# EasyEDA Pro project ProPrj_FlightComputerV1_2026-02-14.epro

# Schematic Schematic1
Board Name: Board1; Create Date: 2026-01-06; Page Name: P1; Project Name: FlightComputerV1; Schematic Name: Schematic1; Update Date: 2026-02-13; Company: EasyEDA.com; Page Size: A4; Version: V1.0
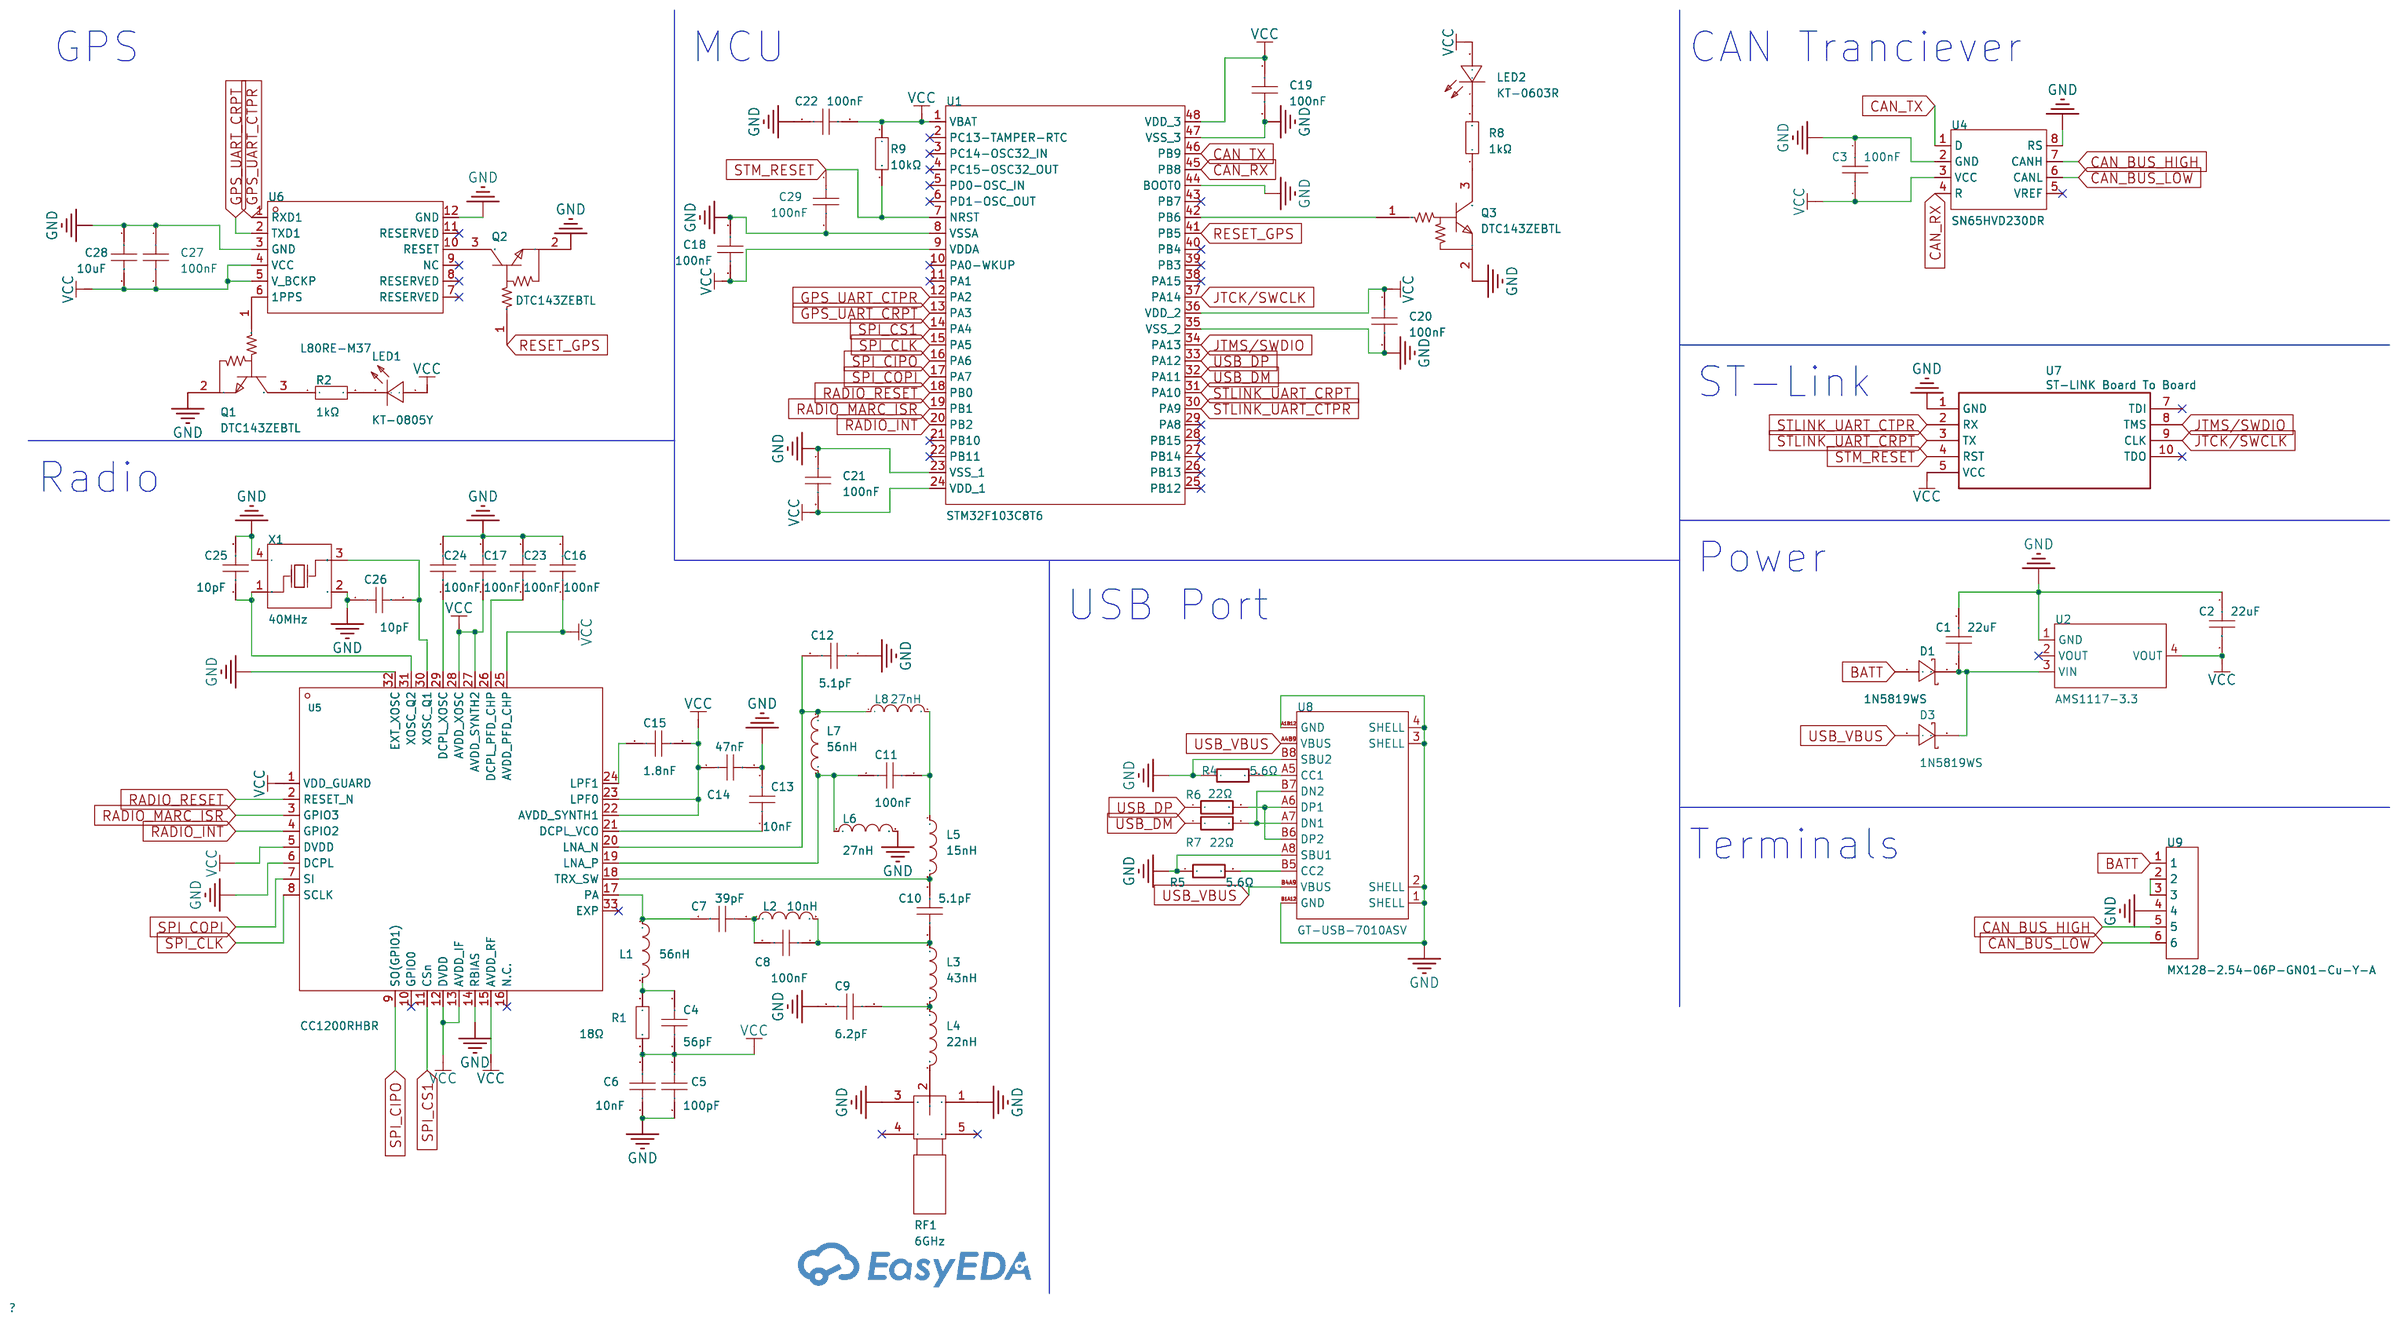
[diagram p0: schematic sheet]

## Parts
C1  22uF  [C0805]
C2  22uF  [C0805]
C3  100nF  [C0402]
C4  56pF  [C0402]
C5  100pF  [C0402]
C6  10nF  [C0402]
C7  39pF  [C0402]
C8  100nF  [C0402]
C9  6.2pF  [C0402]
C10  5.1pF  [C0402]
C11  100nF  [C0402]
C12  5.1pF  [C0402]
C13  10nF  [C0402]
C14  47nF  [C0402]
C15  1.8nF  [C0402]
C16  100nF  [C0402]
C17  100nF  [C0402]
C18  100nF  [C0402]
C19  100nF  [C0402]
C20  100nF  [C0402]
C21  100nF  [C0402]
C22  100nF  [C0402]
C23  100nF  [C0402]
C24  100nF  [C0402]
C25  10pF  [C0402]
C26  10pF  [C0402]
C27  100nF  [C0402]
C28  10uF  [C0603]
C29  100nF  [C0402]
D1  1N5819WS  [SOD-323_L1.8-W1.3-LS2.5-RD]
D3  1N5819WS  [SOD-323_L1.8-W1.3-LS2.5-RD]
L1  56nH  [L0402-R-RD]
L2  10nH  [L0402]
L3  43nH  [L0402]
L4  22nH  [L0402]
L5  15nH  [L0402-RD]
L6  27nH  [L0402-RD]
L7  56nH  [L0402-R-RD]
L8  27nH  [L0402-RD]
LED1  KT-0805Y  [LED0805-R-RD]
LED2  KT-0603R  [LED0603-RD]
Q1  DTC143ZEBTL  [SC-89-3_L1.6-W0.9-P1.00-LS1.6-BR]
Q2  DTC143ZEBTL  [SC-89-3_L1.6-W0.9-P1.00-LS1.6-BR]
Q3  DTC143ZEBTL  [SC-89-3_L1.6-W0.9-P1.00-LS1.6-BR]
R1  18Ω  [R0805]
R2  1kΩ  [R1206]
R4  5.6Ω  [R1206]
R5  5.6Ω  [R1206]
R6  22Ω  [R0603]
R7  22Ω  [R0603]
R8  1kΩ  [R1206]
R9  10kΩ  [R0402]
RF1  6GHz  [SMA-SMD_HYCW12-SMAW0863-1365B]
U1  STM32F103C8T6  [LQFP-48_L7.0-W7.0-P0.50-LS9.0-BL]
U2  AMS1117-3.3  [SOT-223-3_L6.5-W3.4-P2.30-LS7.0-BR]
U4  SN65HVD230DR  [SOIC-8_L4.9-W3.9-P1.27-LS6.0-BL]
U5  CC1200RHBR  [VQFN-32_L5.0-W5.0-P0.50-TL-EP]
U6  L80RE-M37  [GPSM-SMD_12P-L16.0-W16.0-P2.54-BL]
U7  ST-LINK Board To Board  [ST-LINK BOARD TO BOARD]
U8  GT-USB-7010ASV  [USB-C-SMD_G-SWITCH_GT-USB-7010ASV]
U9  MX128-2.54-06P-GN01-Cu-Y-A  [CONN-TH_6P-P2.54_MX128-2.54-6P]
X1  40MHz  [CRYSTAL-SMD_4P-L2.0-W1.6-BL]

## Library data of the parts
C1 C2 = CL21A226MAQNNNE: Capacitance:22uF Tolerance:±20% Tolerance:±20% Voltage Rating:25V Temperature Coefficient:X5R; LCSC Part Name: 22uF ±20% 25V; Supplier Part: C45783; Manufacturer: SAMSUNG(三星); Supplier Footprint: 0805; JLCPCB Part Class: Basic Part; Datasheet: https://item.szlcsc.com/datasheet/CL21A226MAQNNNE/46786.html; Supplier: LCSC; Tolerance: ±20%; Voltage Rating: 25V; Temperature Coefficient: X5R; Check: true
C3 C8 C11 C16-C24 C27 C29 = TCC0402X5R104M250AT: Capacitance:100nF Tolerance:±20% Tolerance:±20% Voltage Rating:25V Temperature Coefficient:X5R; LCSC Part Name: 100nF ±20% 25V; Supplier Part: C359190; Manufacturer: CCTC(三环); Supplier Footprint: 0402; JLCPCB Part Class: Extended Part; Datasheet: https://item.szlcsc.com/datasheet/TCC0402X5R104M250AT/333878.html; Supplier: LCSC; Tolerance: ±20%; Voltage Rating: 25V; Temperature Coefficient: X5R; Check: true
C4 = TCC0402COG560J500AT: Capacitance:56pF Tolerance:±5% Tolerance:±5% Voltage Rating:50V Temperature Coefficient:C0G; LCSC Part Name: 56pF ±5% 50V; Supplier Part: C696894; Manufacturer: CCTC(三环); Supplier Footprint: 0402; JLCPCB Part Class: Extended Part; Datasheet: https://item.szlcsc.com/datasheet/TCC0402COG560J500AT/730978.html; Supplier: LCSC; Tolerance: ±5%; Voltage Rating: 50V; Temperature Coefficient: C0G; Check: true
C5 = TCC0402COG101K500AT: Capacitance:100pF Tolerance:±10% Tolerance:±10% Voltage Rating:50V Temperature Coefficient:C0G; LCSC Part Name: 100pF ±10% 50V; Supplier Part: C696853; Manufacturer: CCTC(三环); Supplier Footprint: 0402; JLCPCB Part Class: Extended Part; Datasheet: https://item.szlcsc.com/datasheet/TCC0402COG101K500AT/730937.html; Supplier: LCSC; Tolerance: ±10%; Voltage Rating: 50V; Temperature Coefficient: C0G; Check: true
C6 C13 = TCC0402X7R103M500AT: Capacitance:10nF Tolerance:±20% Tolerance:±20% Voltage Rating:50V Temperature Coefficient:X7R; LCSC Part Name: 10nF ±20% 50V; Supplier Part: C696856; Manufacturer: CCTC(三环); Supplier Footprint: 0402; JLCPCB Part Class: Extended Part; Datasheet: https://item.szlcsc.com/datasheet/TCC0402X7R103M500AT/730940.html; Supplier: LCSC; Tolerance: ±20%; Voltage Rating: 50V; Temperature Coefficient: X7R; Check: true
C7 = TCC0402COG390J500AT: Capacitance:39pF Tolerance:±5% Tolerance:±5% Voltage Rating:50V Temperature Coefficient:C0G; LCSC Part Name: 39pF ±5% 50V; Supplier Part: C696912; Manufacturer: CCTC(三环); Supplier Footprint: 0402; JLCPCB Part Class: Extended Part; Datasheet: https://item.szlcsc.com/datasheet/TCC0402COG390J500AT/730996.html; Supplier: LCSC; Tolerance: ±5%; Voltage Rating: 50V; Temperature Coefficient: C0G; Check: true
C9 = 0402CG6R2C500NT: Capacitance:6.2pF Voltage Rating:50V Temperature Coefficient:C0G; LCSC Part Name: ±0.25pF 6.2pF 50V; Supplier Part: C41744; Manufacturer: FH(风华); Supplier Footprint: 0402; JLCPCB Part Class: Extended Part; Datasheet: https://item.szlcsc.com/datasheet/0402CG6R2C500NT/42730.html; Supplier: LCSC; Voltage Rating: 50V; Temperature Coefficient: C0G; Check: true
C10 C12 = 0402CG5R1C500NT: Capacitance:5.1pF Voltage Rating:50V Temperature Coefficient:C0G; LCSC Part Name: ±0.25pF 5.1pF 50V; Supplier Part: C60220; Manufacturer: FH(风华); Supplier Footprint: 0402; JLCPCB Part Class: Extended Part; Datasheet: https://item.szlcsc.com/datasheet/0402CG5R1C500NT/61272.html; Supplier: LCSC; Voltage Rating: 50V; Temperature Coefficient: C0G; Check: true
C14 = TCC0402X5R473M250AT: Capacitance:47nF Tolerance:±20% Tolerance:±20% Voltage Rating:25V Temperature Coefficient:X5R; LCSC Part Name: 47nF ±20% 25V; Supplier Part: C696864; Manufacturer: CCTC(三环); Supplier Footprint: 0402; JLCPCB Part Class: Extended Part; Datasheet: https://item.szlcsc.com/datasheet/TCC0402X5R473M250AT/730948.html; Supplier: LCSC; Tolerance: ±20%; Voltage Rating: 25V; Temperature Coefficient: X5R; Check: true
C15 = TCC0402X7R182K500AT: Capacitance:1.8nF Tolerance:±10% Tolerance:±10% Voltage Rating:50V Temperature Coefficient:X7R; LCSC Part Name: 1.8nF ±10% 50V; Supplier Part: C696873; Manufacturer: CCTC(三环); Supplier Footprint: 0402; JLCPCB Part Class: Extended Part; Datasheet: https://item.szlcsc.com/datasheet/TCC0402X7R182K500AT/730957.html; Supplier: LCSC; Tolerance: ±10%; Voltage Rating: 50V; Temperature Coefficient: X7R; Check: true
C25 C26 = TCC0402COG100K500AT: Capacitance:10pF Tolerance:±10% Tolerance:±10% Voltage Rating:50V Temperature Coefficient:C0G; LCSC Part Name: 10pF ±10% 50V; Supplier Part: C713505; Manufacturer: CCTC(三环); Supplier Footprint: 0402; JLCPCB Part Class: Extended Part; Datasheet: https://item.szlcsc.com/datasheet/TCC0402COG100K500AT/753905.html; Supplier: LCSC; Tolerance: ±10%; Voltage Rating: 50V; Temperature Coefficient: C0G; Check: true
C28 = CL10A106MQ8NNNC: Capacitance:10uF Tolerance:±20% Tolerance:±20% Voltage Rating:6.3V Temperature Coefficient:X5R; LCSC Part Name: 10uF ±20% 6.3V; Supplier Part: C1691; Manufacturer: SAMSUNG(三星); Supplier Footprint: 0603; JLCPCB Part Class: Extended Part; Datasheet: https://item.szlcsc.com/datasheet/CL10A106MQ8NNNC/2043.html; Supplier: LCSC; Tolerance: ±20%; Voltage Rating: 6.3V; Temperature Coefficient: X5R; Check: true
D1 D3 = 1N5819WS_C191023: Voltage - Forward(Vf@If):600mV@1A Voltage - DC Reverse(Vr):40V Current - Rectified:1A Non-Repetitive Peak Forward Surge Current:25A; LCSC Part Name: 电压:40V 电流:1A; Supplier Part: C191023; Manufacturer: Hottech(合科泰); Supplier Footprint: SOD-323; JLCPCB Part Class: Basic Part; Datasheet: https://item.szlcsc.com/datasheet/1N5819WS/213850.html; Supplier: LCSC; Voltage - Forward(Vf@If): 600mV@1A; Voltage - DC Reverse(Vr): 40V; Current - Rectified: 1A; Non-Repetitive Peak Forward Surge Current: 25A; Check: true
L1 L7 = MLG1005S56NJT000: Inductance:56nH Tolerance:±5% Tolerance:±5% Current Rating:200mA Current - Saturation (Isat):- DC Resistance(DCR):830mΩ Q @ Frequency:8@100MHz Frequency - Self Resonant:1GHz Ratings:-; LCSC Part Name: 56nH ±5%; Supplier Part: C76777; Manufacturer: TDK; Supplier Footprint: 0402; JLCPCB Part Class: Extended Part; Datasheet: https://item.szlcsc.com/datasheet/MLG1005S56NJT000/77904.html; Supplier: LCSC; Tolerance: ±5%; Current Rating: 200mA; DC Resistance(DCR): 830mΩ; Q @ Frequency: 8@100MHz; Frequency - Self Resonant: 1GHz; Check: true
L2 = VHF100505H10NJT: Inductance:10nH Tolerance:±5% Tolerance:±5% Current Rating:250mA Current - Saturation (Isat):- DC Resistance(DCR):470mΩ Q @ Frequency:7@100MHz Frequency - Self Resonant:3.2GHz Ratings:- Type:High-Frequency Inductor；Multilayer Inductor; LCSC Part Name: 10nH ±5%; Supplier Part: C90140; Manufacturer: FH(风华); Supplier Footprint: 0402; JLCPCB Part Class: Extended Part; Datasheet: https://item.szlcsc.com/datasheet/VHF100505H10NJT/91325.html; Supplier: LCSC; Tolerance: ±5%; Current Rating: 250mA; DC Resistance(DCR): 470mΩ; Q @ Frequency: 7@100MHz; Frequency - Self Resonant: 3.2GHz; Type: High-Frequency Inductor；Multilayer Inductor; Check: true
L3 = VHF100505HQ43NJT: Inductance: Tolerance:±5% Tolerance:±5% Rated Current: Saturation Current (Isat):- DC Resistance (DCR): Q @ Freq:- Frequency - Self Resonant:- Ratings:; LCSC Part Name: 43nH ±5%; Supplier Part: C395067; Manufacturer: FH(风华); Supplier Footprint: 0402; JLCPCB Part Class: Extended Part; Datasheet: https://atta.szlcsc.com/upload/public/pdf/source/20230208/097A5FD33363C9318A1C8B9447979AC6.pdf; Supplier: LCSC; Tolerance: ±5%; Check: true
L4 = VHF100505HQ22NJT: Inductance: Tolerance:±5% Tolerance:±5% Rated Current: Saturation Current (Isat):- DC Resistance (DCR): Q @ Freq:- Frequency - Self Resonant:- Ratings:; LCSC Part Name: 22nH ±5%; Supplier Part: C395059; Manufacturer: FH(风华); Supplier Footprint: 0402; JLCPCB Part Class: Extended Part; Datasheet: https://atta.szlcsc.com/upload/public/pdf/source/20230208/097A5FD33363C9318A1C8B9447979AC6.pdf; Supplier: LCSC; Tolerance: ±5%; Check: true
L5 = VHF100505H15NKT: Inductance: Tolerance:±10% Tolerance:±10% Rated Current: Saturation Current (Isat):- DC Resistance (DCR): Q @ Freq:- Frequency - Self Resonant:- Ratings:; LCSC Part Name: 15nH ±10%; Supplier Part: C381880; Manufacturer: FH(风华); Supplier Footprint: 0402; JLCPCB Part Class: Extended Part; Datasheet: https://atta.szlcsc.com/upload/public/pdf/source/20190415/C381906_6569A9E315E68CF95F175A191F7B4691.pdf; Supplier: LCSC; Tolerance: ±10%; Check: true
L6 L8 = LQG15HS27NJ02D: Inductance:27nH Tolerance:±5% Tolerance:±5% Current Rating:350mA Current - Saturation (Isat):- DC Resistance(DCR):460mΩ Q @ Frequency:8@100MHz Frequency - Self Resonant:1.7GHz Ratings:-; LCSC Part Name: 27nH ±5%; Supplier Part: C12669; Manufacturer: muRata(村田); Supplier Footprint: 0402; JLCPCB Part Class: Extended Part; Datasheet: https://item.szlcsc.com/datasheet/LQG15HS27NJ02D/13305.html; Supplier: LCSC; Tolerance: ±5%; Current Rating: 350mA; DC Resistance(DCR): 460mΩ; Q @ Frequency: 8@100MHz; Frequency - Self Resonant: 1.7GHz; Check: true
LED1 = KT-0805Y: Illumination Color:Yellow Voltage - Forward(Vf):1.8V~2.4V Voltage - Forward(Vf):1.8V~2.4V Power(Watts):40mW Forward Current:- Wavelength - Dominant:584nm~594nm Wavelength - Dominant:584nm~594nm Peak Wavelength:596nm Diode Configuration:- Lens Color:Water; LCSC Part Name: 0805 黄灯 高亮; Supplier Part: C2296; Manufacturer: KENTO; Supplier Footprint: 0805; Datasheet: https://item.szlcsc.com/datasheet/KT-0805Y/2669.html; Supplier: LCSC; Illumination Color: Yellow; Voltage - Forward(Vf): 1.8V~2.4V; Power(Watts): 40mW; Wavelength - Dominant: 584nm~594nm; Peak Wavelength: 596nm; Lens Color: Water Clear; Luminous Intensity: 175mcd; Viewing Angle: 120°; Operating Temperature: -40℃~+85℃
LED2 = KT-0603R: Emitted Color:Red Power Dissipation:- Forward Current:- Dominant Wavelength:- Dominant Wavelength:- Peak Wavelength:- Diode Configuration:- Lens Color:- Color Temperature:- Color Temperature:- Viewing Angle:- Mounting Sytle:- Operating Temperature:-40℃~+8; LCSC Part Name: 0603 红灯 高亮; Supplier Part: C2286; Manufacturer: KENTO; Supplier Footprint: 0603; Datasheet: https://atta.szlcsc.com/upload/public/pdf/source/20160616/1466072038404.pdf; Supplier: LCSC; Emitted Color: Red; Operating Temperature: -40℃~+85℃
Q1-Q3 = DTC143ZEBTL: Number:- Collector - Emitter Voltage VCEO:50V Current - Collector(Ic):100mA Pd - Power Dissipation:150mW DC Current Gain:80@10mA,5V Input Voltage (VI(on)@Ic,Vce):1.3V@5mA,0.3V Voltage - Input(Max)(VI(off)):500mV@100uA,5V Output Voltage(VO(on)):300mV@5mA,0; LCSC Part Name: NPN 100mA 50V 数字晶体管（内置偏置电阻晶体管）; Supplier Part: C308696; Manufacturer: ROHM(罗姆); Supplier Footprint: SC-89; JLCPCB Part Class: Extended Part; Datasheet: https://item.szlcsc.com/datasheet/DTC143ZEBTL/292370.html; Supplier: LCSC; Collector - Emitter Voltage VCEO: 50V; Current - Collector(Ic): 100mA; Pd - Power Dissipation: 150mW; DC Current Gain: 80@10mA,5V; Input Voltage (VI(on)@Ic,Vce): 1.3V@5mA,0.3V; Voltage - Input(Max)(VI(off)): 500mV@100uA,5V; Output Voltage(VO(on)): 300mV@5mA,0.25mA; Input Resistor: 4.7kΩ; Resistor Ratio: 10; Operating Temperature: -40℃~+150℃; Check: true
R1 = 0805W8F180JT5E: Type:Thick Film Resistor Resistance:18Ω Tolerance:±1% Tolerance:±1% Power(Watts):125mW Voltage-Supply(Max):150V Temperature Coefficient:±200ppm/℃ Temperature Coefficient:±200ppm/℃ Operating Temperature:-55℃~+155℃ Operating Temperature:-55℃~+155℃; LCSC Part Name: 18Ω ±1% 125mW 厚膜电阻; Supplier Part: C17507; Manufacturer: UNI-ROYAL(厚声); Supplier Footprint: 0805; JLCPCB Part Class: Extended Part; Datasheet: https://item.szlcsc.com/datasheet/0805W8F180JT5E/18195.html; Supplier: LCSC; Type: Thick Film Resistor; Tolerance: ±1%; Power(Watts): 125mW; Voltage-Supply(Max): 150V; Temperature Coefficient: ±200ppm/℃; Operating Temperature: -55℃~+155℃; Check: true
R2 R8 = 1206W4J0102T5E_C1469: Type:Thick Film Resistor Resistance:1kΩ Tolerance:±5% Tolerance:±5% Power(Watts):250mW Voltage-Supply(Max):200V Temperature Coefficient:±100ppm/℃ Temperature Coefficient:±100ppm/℃ Operating Temperature:-55℃~+155℃ Operating Temperature:-55℃~+155℃; LCSC Part Name: 1kΩ ±5% 250mW 厚膜电阻; Supplier Part: C1469; Manufacturer: UNI-ROYAL(厚声); Manufacturer Part: 1206W4J0102T5E; Supplier Footprint: 1206; JLCPCB Part Class: Extended Part; Datasheet: https://item.szlcsc.com/datasheet/1206W4J0102T5E/1821.html; Supplier: LCSC; Type: Thick Film Resistor; Tolerance: ±5%; Power(Watts): 250mW; Voltage-Supply(Max): 200V; Temperature Coefficient: ±100ppm/℃; Operating Temperature: -55℃~+155℃; Check: true
R4 R5 = RTT065R60FTP: Type:Thick Film Resistor Resistance:5.6Ω Tolerance:±1% Tolerance:±1% Power(Watts):250mW Voltage-Supply(Max):150V Temperature Coefficient:±200ppm/℃ Temperature Coefficient:±200ppm/℃ Operating Temperature:-55℃~+155℃ Operating Temperature:-55℃~+155℃; LCSC Part Name: 厚膜电阻 5.6Ω ±1% 250mW; Supplier Part: C4516; Manufacturer: RALEC(旺诠); Supplier Footprint: 1206; JLCPCB Part Class: Extended Part; Datasheet: https://item.szlcsc.com/datasheet/RTT065R60FTP/4923.html; Supplier: LCSC; Type: Thick Film Resistor; Tolerance: ±1%; Power(Watts): 250mW; Voltage-Supply(Max): 150V; Temperature Coefficient: ±200ppm/℃; Operating Temperature: -55℃~+155℃; Check: true
R6 R7 = 0603WAJ0220T5E: Type:Thick Film Resistors Resistance: Tolerance:±5% Tolerance:±5% Power(Watts): Overload Voltage (Max): Temperature Coefficient:±200ppm/℃ Temperature Coefficient:±200ppm/℃ Operating Temperature Range:-55℃~+155℃ Operating Temperature Range:-55℃~+155℃; LCSC Part Name: 22Ω ±5% 100mW 厚膜电阻; Supplier Part: C1203; Manufacturer: UNI-ROYAL(厚声); Supplier Footprint: 0603; JLCPCB Part Class: Extended Part; Datasheet: https://atta.szlcsc.com/upload/public/pdf/source/20200306/C422600_1E6D84923E4A46A82E41ADD87F860B5C.pdf; Supplier: LCSC; Type: Thick Film Resistors; Tolerance: ±5%; Temperature Coefficient: ±200ppm/℃; Operating Temperature Range: -55℃~+155℃; Check: true
R9 = 0402WGF1002TCE: Type:Thick Film Resistor Resistance:10kΩ Tolerance:±1% Tolerance:±1% Power(Watts):62.5mW Voltage-Supply(Max):50V Temperature Coefficient:±100ppm/℃ Temperature Coefficient:±100ppm/℃ Operating Temperature:-55℃~+155℃ Operating Temperature:-55℃~+155℃; LCSC Part Name: 10kΩ ±1% 62.5mW 厚膜电阻; Supplier Part: C25744; Manufacturer: UNI-ROYAL(厚声); Supplier Footprint: 0402; JLCPCB Part Class: Basic Part; Datasheet: https://item.szlcsc.com/datasheet/0402WGF1002TCE/26487.html; Supplier: LCSC; Type: Thick Film Resistor; Tolerance: ±1%; Power(Watts): 62.5mW; Voltage-Supply(Max): 50V; Temperature Coefficient: ±100ppm/℃; Operating Temperature: -55℃~+155℃
RF1 = HYCW12-SMAW0863-1365B: Connector Type:Board Side Interface:Inner Bore Number of Ports:1 Interface Diameter:5.2mm Interface Length/Height:8mm Frequency:6GHz RF Series:SMA Impedance:50Ω Operating Temperature Range:-55℃~+155℃ Operating Temperature Range:-55℃~+155℃; LCSC Part Name: 内孔 SMA; Supplier Part: C5301850; Manufacturer: 华宇创; Supplier Footprint: SMD; Datasheet: https://item.szlcsc.com/datasheet/HYCW12-SMAW0863-1365B/6053469.html; Supplier: LCSC; Connector Type: Board Side; Interface: Inner Bore; Number of Ports: 1; Interface Diameter: 5.2mm; Interface Length/Height: 8mm; RF Series: SMA; Impedance: 50Ω; Operating Temperature Range: -55℃~+155℃
U1 = STM32F103C8T6: CPU Core:ARM-M3 CPU Maximum Speed:72MHz Program Storage Size:64KB Program Memory Type:FLASH Number of I/O:37 ADC (Bit):12bit Voltage - Supply:2V~3.6V Voltage - Supply:2V~3.6V Applications:-; LCSC Part Name: 主流增强型ARM Cortex-M3 MCU，具有64 KB Flash、72 MHz CPU、电机控制、USB和CAN; Supplier Part: C8734; Manufacturer: ST(意法半导体); Supplier Footprint: LQFP-48(7x7); JLCPCB Part Class: Extended Part; Datasheet: https://item.szlcsc.com/datasheet/STM32F103C8T6/9243.html; Supplier: LCSC; CPU Core: ARM-M3; CPU Maximum Speed: 72MHz; Program Storage Size: 64KB; Program Memory Type: FLASH; Number of I/O: 37; ADC (Bit): 12bit; Voltage - Supply: 2V~3.6V; Check: true
U2 = AMS1117-3.3_C6186: Output Type:Fixed Voltage - Supply:16V Output Voltage:3.3V Output Voltage:3.3V Output Current:1A Power Supply Rejection Ratio (PSRR):72dB@(120Hz) Voltage Dropout:1.1V@(800mA) standby current:5mA Noise:0.003%Vout Features:Over Current Protection；Over Tempe; LCSC Part Name: 输出3.3V 1A; Supplier Part: C6186; Manufacturer: AMS; Supplier Footprint: SOT-223; JLCPCB Part Class: Basic Part; Datasheet: https://item.szlcsc.com/datasheet/AMS1117-3.3/6652.html; Supplier: LCSC; Output Type: Fixed; Voltage - Supply: 16V; Output Voltage: 3.3V; Output Current: 1A; Power Supply Rejection Ratio (PSRR): 72dB@(120Hz); Voltage Dropout: 1.1V@(800mA); standby current: 5mA; Noise: 0.003%Vout; Features: Over Current Protection；Over Temperature Protection; Operating Temperature: -40℃~+125℃; Output Configuration: Positive; Number of Outputs: 1; Check: true
U4 = SN65HVD230DR: Type:CANtransceiver Data Rate:1Mbps Voltage - Supply:- Voltage - Supply:- Current - Supply:- Operating Temperature:-40℃~+85℃ Operating Temperature:-40℃~+85℃; LCSC Part Name: 3.3-V CAN 收发器; Supplier Part: C12084; Manufacturer: TI(德州仪器); Supplier Footprint: SOIC-8; JLCPCB Part Class: Extended Part; Datasheet: https://www.ti.com/cn/lit/gpn/sn65hvd230; Supplier: LCSC; Type: CANtransceiver; Data Rate: 1Mbps; Operating Temperature: -40℃~+85℃; Check: true
U5 = CC1200RHBR: Frequency Range:164MHz~950MHz Frequency Range:164MHz~950MHz Interface:SPI Voltage - Supply:2V~3.6V Voltage - Supply:2V~3.6V Applications:ISM；802.15.4 Output Power:16dBm Data Rate:1.25Mbps Current Of Transmitting:46mA Sensitivity:-123dBm Receive Current:23; Supplier Part: C122881; Manufacturer: TI(德州仪器); Supplier Footprint: VQFN-32-EP(5x5); JLCPCB Part Class: Extended Part; Datasheet: https://www.ti.com/cn/lit/gpn/cc1200; Supplier: LCSC; Frequency Range: 164MHz~950MHz; Interface: SPI; Voltage - Supply: 2V~3.6V; Applications: ISM；802.15.4; Output Power: 16dBm; Data Rate: 1.25Mbps; Current Of Transmitting: 46mA; Sensitivity: -123dBm; Receive Current: 23mA; Typical Application Frequency: 869.5MHz; Operating Temperature: -40℃~+85℃; Check: true
U6 = L80RE-M37: Voltage - Supply:3V~4.3V Voltage - Supply:3V~4.3V Sensitivity:-165dBm Sensitivity:-165dBm Operating Temperature:-40℃~+85℃ Operating Temperature:-40℃~+85℃; LCSC Part Name: GPS模块; Supplier Part: C3029061; Manufacturer: Quectel(移远); Supplier Footprint: SMD-12P; Datasheet: https://item.szlcsc.com/datasheet/L80RE-M37/3559900.html; Supplier: LCSC; Voltage - Supply: 3V~4.3V; Sensitivity: -165dBm; Operating Temperature: -40℃~+85℃; Check: true
U7 = ST-LINK Board To Board: Check: false
U8 = GT-USB-7010ASV: Connector Type:Type-C Standard:USB 2.0 Gender:Female Mounting Style:Horizontal attachment Number of Contacts:16P Number of Ports:1 Current Rating - Power (Max):3A Rated Voltage (Max):24V Connect-Disconnect Life:10,000 times Center Height:1.68mm Length:7.3; LCSC Part Name: Type-C 母 卧贴; Supplier Part: C2988369; Manufacturer: G-Switch(品赞); Supplier Footprint: SMD; JLCPCB Part Class: Extended Part; Datasheet: https://atta.szlcsc.com/upload/public/pdf/source/20230327/DF227B64686AC8FA0AD1775797F2C3F1.pdf; Supplier: LCSC; Connector Type: Type-C; Standard: USB 2.0; Gender: Female; Mounting Style: Horizontal attachment; Number of Contacts: 16P; Number of Ports: 1; Current Rating - Power (Max): 3A; Rated Voltage (Max): 24V; Connect-Disconnect Life: 10,000 times; Center Height: 1.68mm; Length: 7.35mm; Core Colour: Black; Operating Temperature Range: -40℃~+85℃; Check: true
U9 = MX128-2.54-06P-GN01-Cu-Y-A: Number of Positions or Pins:1x6P Pitch:2.54mm Color:Green Mounting Type:Through Hole Number of Pins:6P Number of Rows:1 Number of PINs Per Row:6 Screw Specification:M1.6 Current Rating:6A Voltage Rating (Max):150V Wire Gauge - AWG:18~24 Wire Gauge - mm2:1; LCSC Part Name: 1x6P 2.54mm 直插 排数:1 每排P数:6; Supplier Part: C5188446; Manufacturer: MAX(迈旭); Supplier Footprint: 插件,P=2.54mm; JLCPCB Part Class: Extended Part; Datasheet: https://item.szlcsc.com/datasheet/MX128-2.54-06P-GN01-Cu-Y-A/5862530.html; Supplier: LCSC; Number of Positions or Pins: 1x6P; Pitch: 2.54mm; Color: Green; Mounting Type: Through Hole; Number of Pins: 6P; Number of Rows: 1; Number of PINs Per Row: 6; Screw Specification: M1.6; Current Rating: 6A; Voltage Rating (Max): 150V; Wire Gauge - AWG: 18~24; Wire Gauge - mm2: 1; Operating Temperature: -40℃~+105℃
X1 = Q22FA12800101: Type:Crystal Oscillator Frequency:40MHz Normal temperature Frequency Tolerance:±10ppm Normal temperature Frequency Tolerance:±10ppm Load Capacitance:10pF Equivalent Series Resistance(ESR):60Ω Operating Temperature:-40℃~+85℃ Operating Temperature:-40℃~+85℃; LCSC Part Name: 40MHz ±10ppm 10pF; Supplier Part: C255898; Manufacturer: EPSON(爱普生); Supplier Footprint: SMD2016-4P; JLCPCB Part Class: Extended Part; Datasheet: https://item.szlcsc.com/datasheet/Q22FA12800101/249663.html; Supplier: LCSC; Type: Crystal Oscillator; Normal temperature Frequency Tolerance: ±10ppm; Load Capacitance: 10pF; Equivalent Series Resistance(ESR): 60Ω; Operating Temperature: -40℃~+85℃; Check: true

## Nets
GND: C1.2 C2.1 C3.1 C5.1 C6.1 C9.1 C12.1 C13.1 C14.2 C16.2 C17.1 C18.1 C19.2 C20.2 C21.1 C22.1 C23.1 C24.1 C25.2 C26.1 C27.1 C28.1 C29.2 L6.2 Q1.2(E) Q2.2(E) Q3.2(E) R4.1 R5.1 RF1.1 RF1.3 U1.8(VSSA) U1.23(VSS_1) U1.35(VSS_2) U1.44(BOOT0) U1.47(VSS_3) U2.1(GND) U4.2(GND) U4.8(RS) U5.6(DCPL) U5.14(RBIAS) U5.32(EXT_XOSC) U6.3(GND) U6.12(GND) U7.1(GND) U8.1(SHELL) U8.2(SHELL) U8.3(SHELL) U8.4(SHELL) U8.A1B12(GND) U8.A8(SBU1) U8.B1A12(GND) U8.B8(SBU2) U9.4 X1.2 X1.4
VCC: C2.2 C3.2 C4.1 C5.2 C6.2 C14.1 C15.2 C16.1 C17.2 C18.2 C19.1 C20.1 C21.2 C22.2 C27.2 C28.2 LED1.1(+) LED2.2(A) R1.2 R9.1 U1.1(VBAT) U1.9(VDDA) U1.24(VDD_1) U1.36(VDD_2) U1.48(VDD_3) U2.4(VOUT) U4.3(VCC) U5.1(VDD_GUARD) U5.5(DVDD) U5.12(DVDD) U5.13(AVDD_IF) U5.15(AVDD_RF) U5.22(AVDD_SYNTH1) U5.23(LPF0) U5.25(AVDD_PFD_CHP) U5.27(AVDD_SYNTH2) U5.28(AVDD_XOSC) U6.4(VCC) U6.5(V_BCKP) U7.5(VCC)
BATT: D1.2(A) U9.1
CAN_BUS_HIGH: U4.7(CANH) U9.5
CAN_BUS_LOW: U4.6(CANL) U9.6
CAN_RX: U1.45(PB8) U4.4(R)
CAN_TX: U1.46(PB9) U4.1(D)
GPS_UART_CRPT: U1.13(PA3) U6.2(TXD1)
GPS_UART_CTPR: U1.12(PA2) U6.1(RXD1)
JTCK/SWCLK: U1.37(PA14) U7.9(CLK)
JTMS/SWDIO: U1.34(PA13) U7.8(TMS)
RADIO_INT: U1.20(PB2) U5.4(GPIO2)
RADIO_MARC_ISR: U1.19(PB1) U5.3(GPIO3)
RADIO_RESET: U1.18(PB0) U5.2(RESET_N)
RESET_GPS: Q2.1(B) U1.41(PB5)
SPI_CIPO: U1.16(PA6) U5.9(SO(GPIO1))
SPI_CLK: U1.15(PA5) U5.8(SCLK)
SPI_COPI: U1.17(PA7) U5.7(SI)
SPI_CS1: U1.14(PA4) U5.11(CSn)
STLINK_UART_CRPT: U1.31(PA10) U7.3(TX)
STLINK_UART_CTPR: U1.30(PA9) U7.2(RX)
STM_RESET: C29.1 R9.2 U1.7(NRST) U7.4(RST)
USB_DM: R7.1 U1.32(PA11)
USB_DP: R6.1 U1.33(PA12)
USB_VBUS: D3.2(A) U8.A4B9(VBUS) U8.B4A9(VBUS)
$1N610: C1.1 D1.1(K) D3.1(K) U2.3(VIN)
$1N3382: C7.2 L1.1 U5.17(PA)
$1N4219: C4.2 L1.2 R1.1
$1N4594: C7.1 C8.2 L2.1
$1N4599: C8.1 C10.1 L2.2 L3.1
$1N4710: C9.2 L3.2 L4.1
$1N4837: C10.2 L5.2 U5.18(TRX_SW)
$1N5012: C11.2 L6.1 L7.1 U5.19(LNA_P)
$1N5016: C11.1 L5.1 L8.2
$1N5163: C12.2 L7.2 L8.1 U5.20(LNA_N)
$1N5399: C13.2 U5.21(DCPL_VCO)
$1N5596: C15.1 U5.24(LPF1)
$1N5799: C23.2 U5.26(DCPL_PFD_CHP)
$1N6125: C24.2 U5.29(DCPL_XOSC)
$1N6415: C26.2 U5.30(XOSC_Q1) X1.3(OSC2)
$1N6423: C25.1 U5.31(XOSC_Q2) X1.1(OSC1)
$1N7162: Q1.3(C) R2.1
$1N7211: Q1.1(B) U6.6(1PPS)
$1N7380: Q2.3(C) U6.10(RESET)
$1N13423: R4.2 U8.A5(CC1)
$1N13428: R7.2 U8.A7(DN1) U8.B7(DN2)
$1N13434: R6.2 U8.A6(DP1) U8.B6(DP2)
$1N14041: U9.2 U9.3
$1N14142: LED1.2(-) R2.2
$1N14191: R5.2 U8.B5(CC2)
$1N14380: Q3.3(C) R8.1
$1N14476: LED2.1(K) R8.2
$1N14605: L4.2 RF1.2
$1N18752: Q3.1(B) U1.42(PB6)

Not connected (* = marked no-connect by the designer): RF1 4* 5*; U1 2(PC13-TAMPER-RTC)* 3(PC14-OSC32_IN)* 4(PC15-OSC32_OUT)* 5(PD0-OSC_IN)* 6(PD1-OSC_OUT)* 10(PA0-WKUP)* 11(PA1)* 21(PB10)* 22(PB11)* 25(PB12)* 26(PB13)* 27(PB14)* 28(PB15)* 29(PA8)* 38(PA15)* 39(PB3)* 40(PB4)* 43(PB7)*; U2 2(VOUT)*; U4 5(VREF)*; U5 10(GPIO0)* 16(N.C.)* 33(EXP)*; U6 7(RESERVED)* 8(RESERVED)* 9(NC)* 11(RESERVED)*; U7 7(TDI)* 10(TDO)*

## Notes on the sheet
- GPS
- MCU
- CAN Tranciever
- ST-Link
- Radio
- Power
- USB Port
- Terminals

# Board PCB1
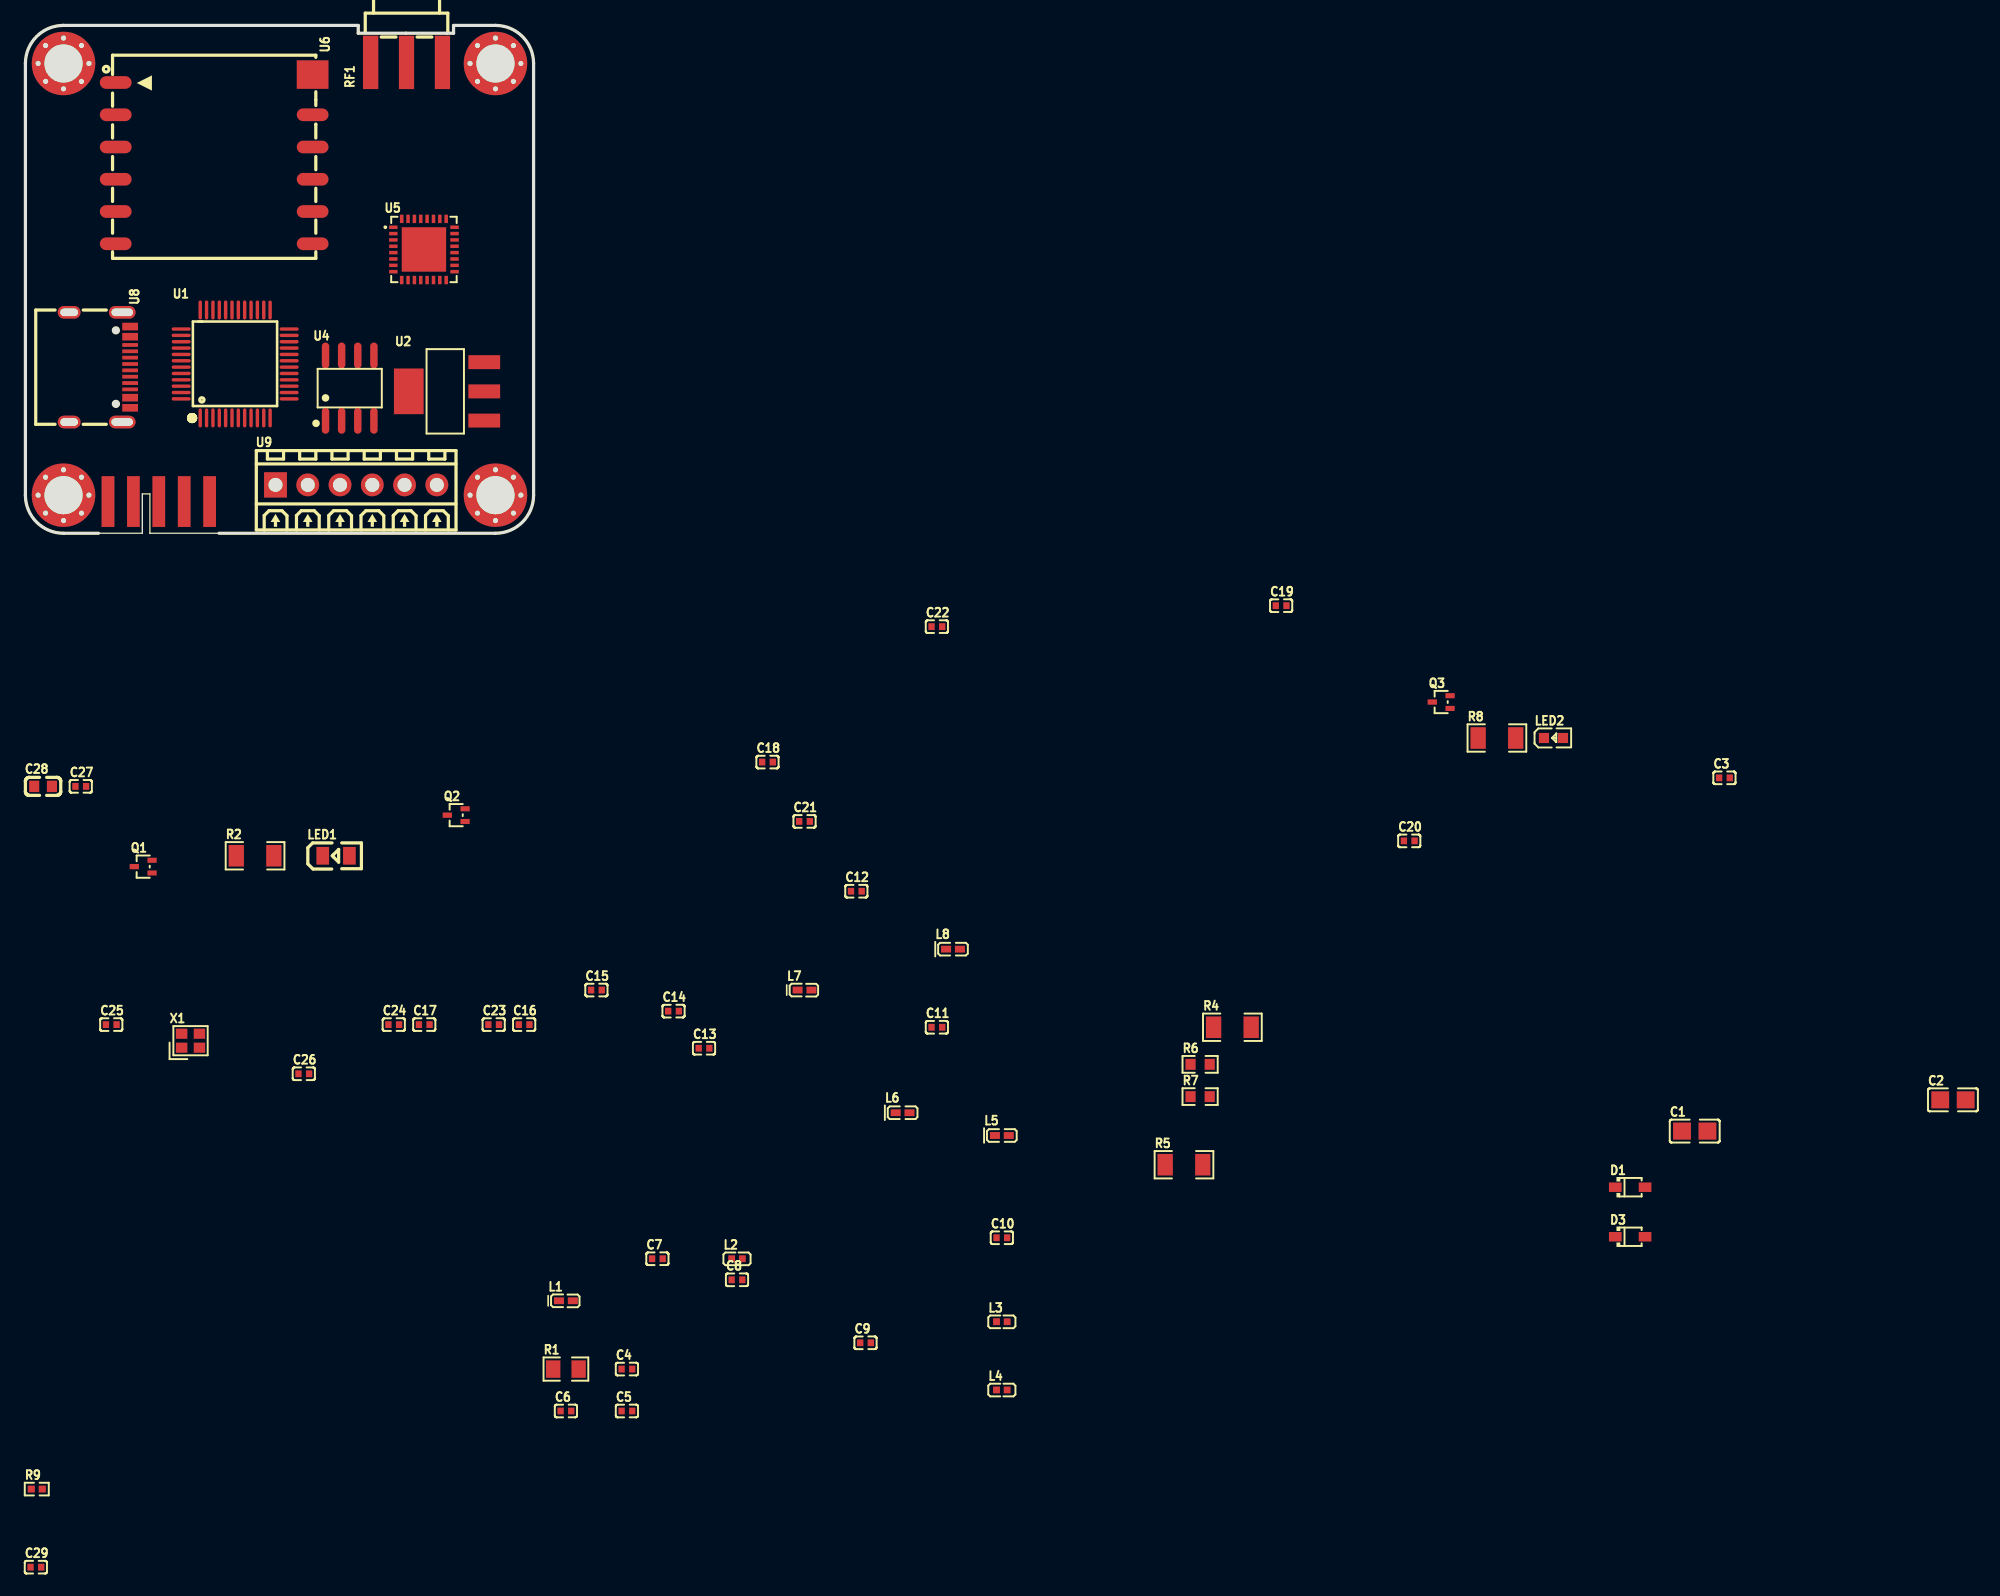
[diagram p1: board, top side]
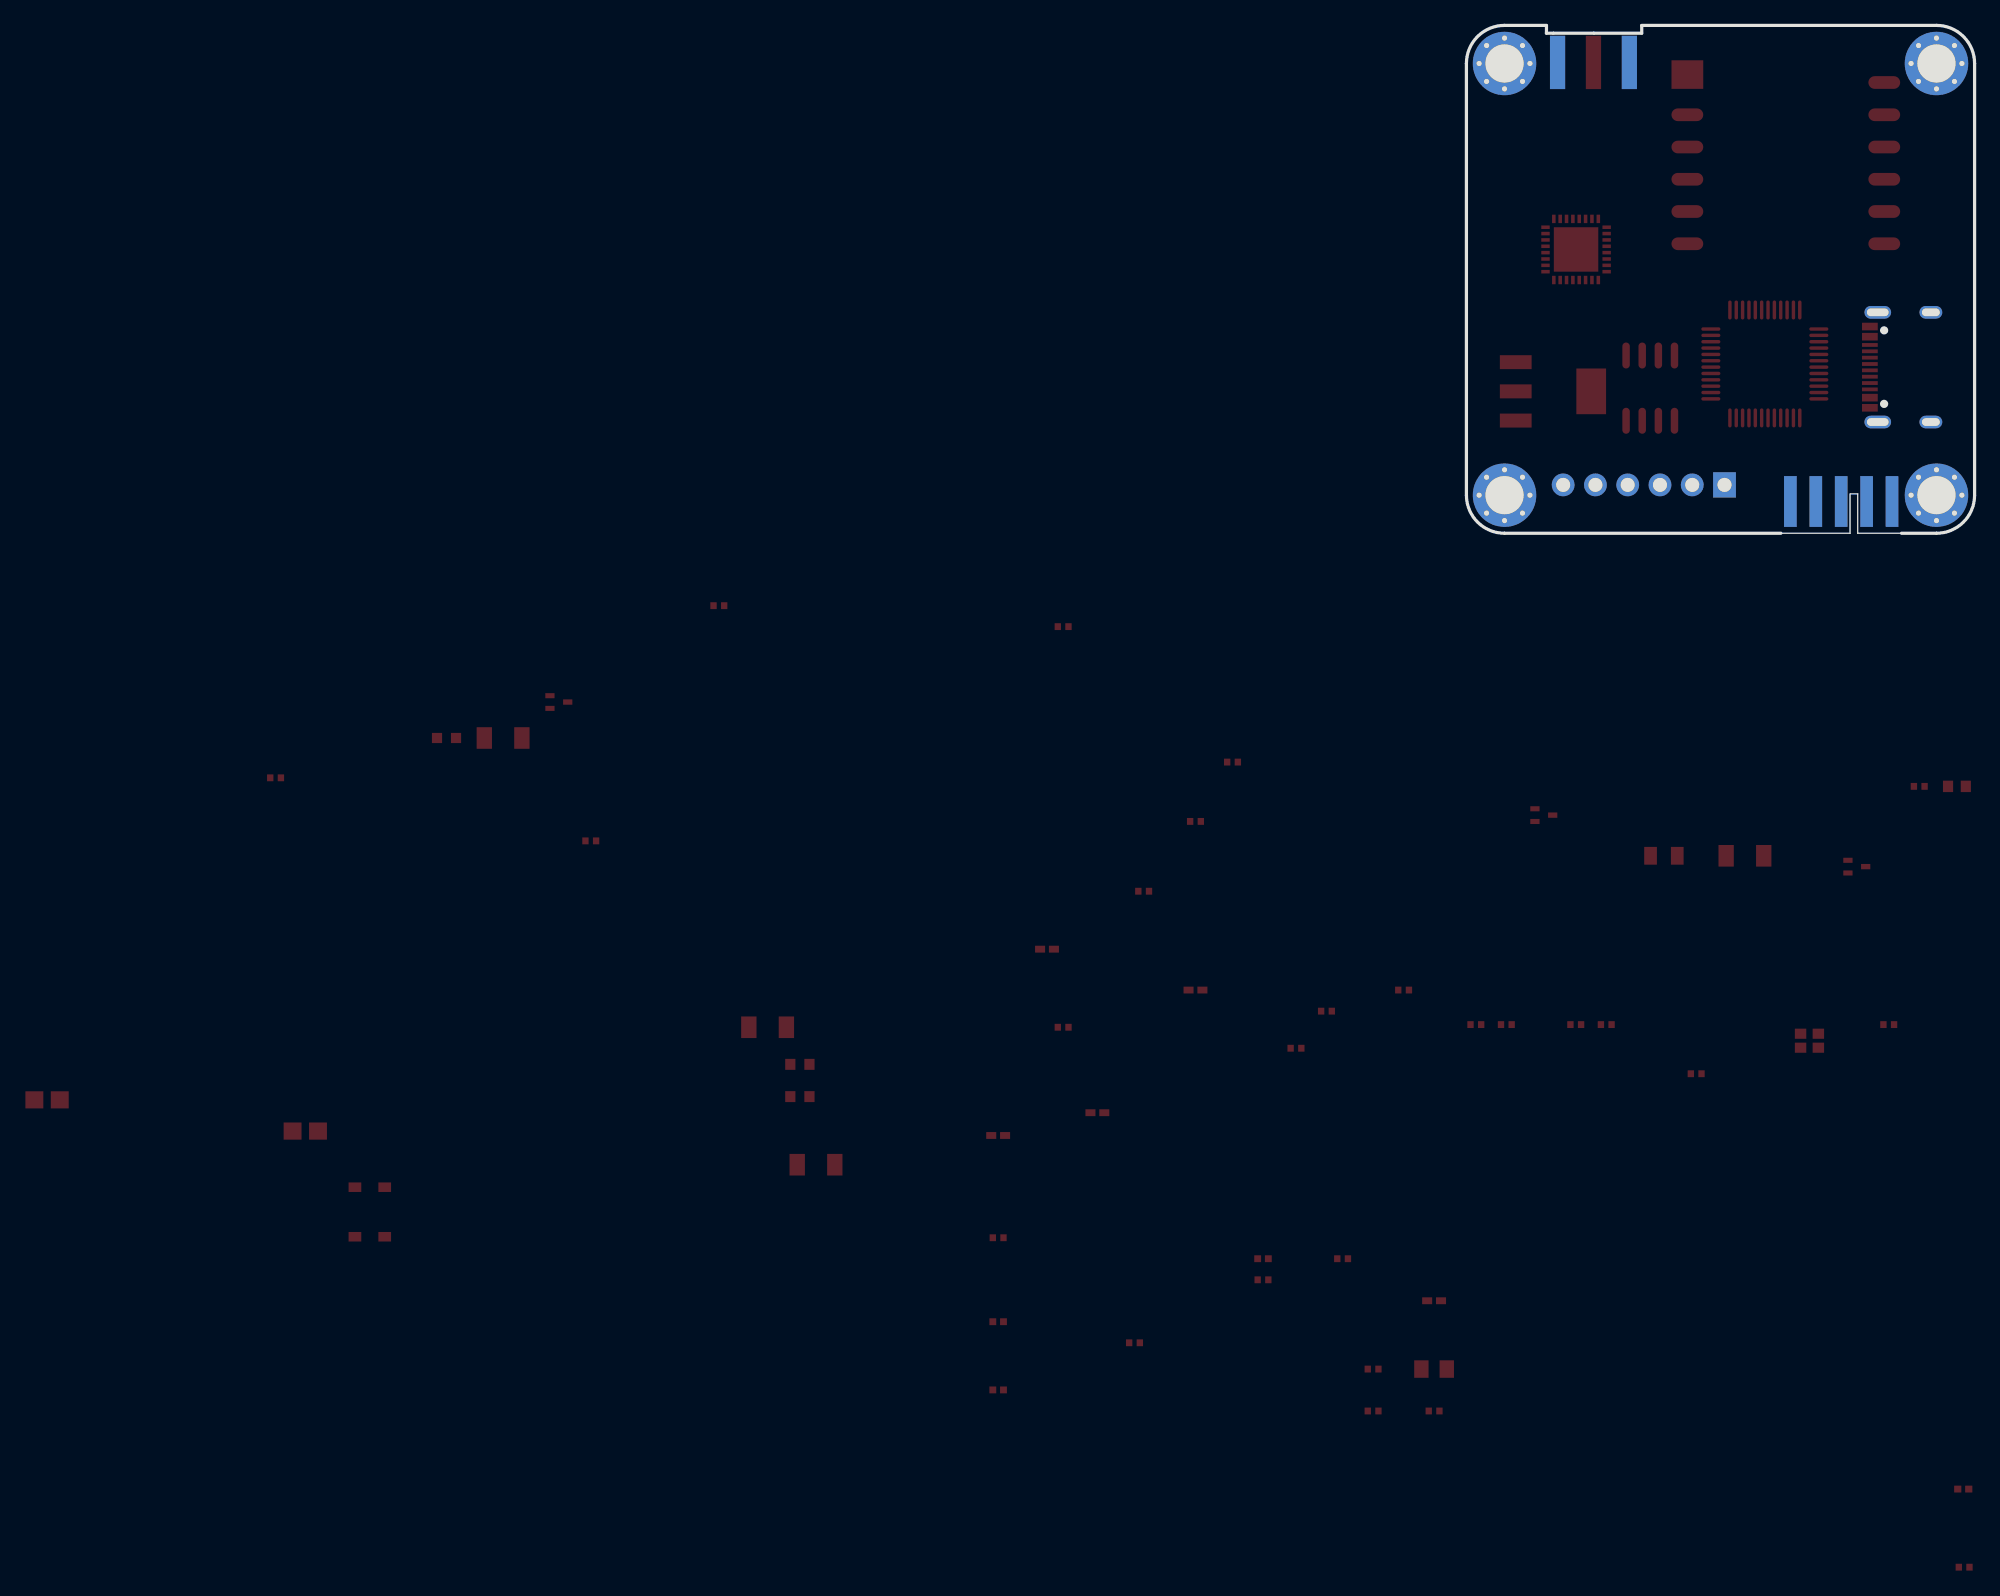
[diagram p2: board, bottom side, seen from below]

Outline 40 x 40 mm; copper layers: Top Layer, Bottom Layer. Coordinates in mm from the lower left corner of the outline.
Outline path: 26.2,40 3,40 arc(0.88,39.12) 0,37 0,3 arc(0.88,0.88) 3,0 5.75,0 ; 15.25,0 37,0 arc(39.12,0.88) 40,3 40,37 arc(39.12,39.12) 37,40 33.7,40
Stack: Top Layer 0.035mm / Dielectric1 1.51mm FR4 er 4.5 / Bottom Layer 0.035mm

## Design rules (mm)
template: JLCPCB Capability(Two Layers Board)
spacing copperThickness1oz (default): track to track 0.102, other pairs 0.152 to 0.3
spacing copperThickness2oz: track to track 0.203, other pairs 0.152 to 0.3
track width copperThickness1oz (default): min 0.127, default 0.254, max 2.54
track width copperThickness2oz: min 0.203, default 0.254, max 2.54
differential pair differentialPair (default): width min 0.127, default 0.254, max 2.54; gap min 0.152, default 0.152
via viaSize (default): diameter min 0.5, default 0.61, max 10; hole min 0.3, default 0.305, max 6.3

## Placement (name value [footprint] x y rotation side)
C1  22uF  [C0805]  131.4 -47.08 0 top
C2  22uF  [C0805]  151.72 -44.62 0 top
C3  100nF  [C0402]  133.74 -19.26 0 top
C4  56pF  [C0402]  47.34 -65.83 0 top
C5  100pF  [C0402]  47.34 -69.13 0 top
C6  10nF  [C0402]  42.54 -69.13 0 top
C7  39pF  [C0402]  49.75 -57.14 0 top
C8  100nF  [C0402]  56.01 -58.8 0 top
C9  6.2pF  [C0402]  66.13 -63.76 0 top
C10  5.1pF  [C0402]  76.86 -55.49 0 top
C11  100nF  [C0402]  71.74 -38.91 0 top
C12  5.1pF  [C0402]  65.41 -28.19 0 top
C13  10nF  [C0402]  53.42 -40.56 0 top
C14  47nF  [C0402]  51.01 -37.64 0 top
C15  1.8nF  [C0402]  44.94 -35.98 0 top
C16  100nF  [C0402]  39.26 -38.7 0 top
C17  100nF  [C0402]  31.39 -38.7 0 top
C18  100nF  [C0402]  58.41 -18.02 0 top
C19  100nF  [C0402]  98.84 -5.7 0 top
C20  100nF  [C0402]  108.93 -24.23 0 top
C21  100nF  [C0402]  61.33 -22.69 0 top
C22  100nF  [C0402]  71.74 -7.35 0 top
C23  100nF  [C0402]  36.86 -38.7 0 top
C24  100nF  [C0402]  28.99 -38.7 0 top
C25  10pF  [C0402]  6.76 -38.7 0 top
C26  10pF  [C0402]  21.91 -42.57 0 top
C27  100nF  [C0402]  4.36 -19.94 0 top
C28  10uF  [C0603]  1.39 -19.94 0 top
C29  100nF  [C0402]  0.82 -81.43 0 top
D1  1N5819WS  [SOD-323_L1.8-W1.3-LS2.5-RD]  126.32 -51.51 0 top
D3  1N5819WS  [SOD-323_L1.8-W1.3-LS2.5-RD]  126.32 -55.41 0 top
L1  56nH  [L0402-R-RD]  42.54 -60.45 0 top
L2  10nH  [L0402]  56.01 -57.14 0 top
L3  43nH  [L0402]  76.86 -62.1 0 top
L4  22nH  [L0402]  76.86 -67.47 0 top
L5  15nH  [L0402-RD]  76.86 -47.43 0 top
L6  27nH  [L0402-RD]  69.05 -45.64 0 top
L7  56nH  [L0402-R-RD]  61.33 -35.98 0 top
L8  27nH  [L0402-RD]  73.01 -32.76 0 top
LED1  KT-0805Y  [LED0805-R-RD]  24.45 -25.4 0 top
LED2  KT-0603R  [LED0603-RD]  120.28 -16.12 0 top
NOREF  -  [Pad_e121]  3 37 0 top
NOREF#2  -  [Pad_e100]  37 1 0 top
NOREF#3  -  [Pad_e91]  1.59 4.41 0 top
NOREF#4  -  [Pad_e90]  4.41 1.59 0 top
NOREF#5  -  [Pad_e82]  3 1 0 top
NOREF#6  -  [Pad_e108]  35 37 0 top
NOREF#7  -  [Pad_e119]  4.41 35.59 0 top
NOREF#8  -  [Pad_e112]  37 37 0 top
NOREF#9  -  [Pad_e107]  35.59 38.41 0 top
NOREF#10  -  [Pad_e113]  5 37 0 top
NOREF#11  -  [Pad_e92]  1.59 1.59 0 top
NOREF#12  -  [Pad_e99]  35 3 0 top
NOREF#13  -  [Pad_e115]  3 39 0 top
NOREF#14  -  [Pad_e116]  1.59 38.41 0 top
NOREF#15  -  [Pad_e96]  38.41 4.41 0 top
NOREF#16  -  [Pad_e103]  37 3 0 top
NOREF#17  -  [Pad_e87]  5 3 0 top
NOREF#18  -  [Pad_e106]  37 39 0 top
NOREF#19  -  [Pad_e89]  4.41 4.41 0 top
NOREF#20  -  [Pad_e102]  35.59 1.59 0 top
NOREF#21  -  [Pad_e101]  38.41 1.59 0 top
NOREF#22  -  [Pad_e97]  37 5 0 top
NOREF#23  -  [Pad_e88]  3 5 0 top
NOREF#24  -  [Pad_e104]  39 37 0 top
NOREF#25  -  [Pad_e111]  35.59 35.59 0 top
NOREF#26  -  [Pad_e117]  1 37 0 top
NOREF#27  -  [Pad_e75]  3 3 0 top
NOREF#28  -  [Pad_e86]  1 3 0 top
NOREF#29  -  [Pad_e98]  35.59 4.41 0 top
NOREF#30  -  [Pad_e114]  4.41 38.41 0 top
NOREF#31  -  [Pad_e120]  1.59 35.59 0 top
NOREF#32  -  [Pad_e110]  38.41 35.59 0 top
NOREF#33  -  [Pad_e95]  39 3 0 top
NOREF#34  -  [Pad_e109]  37 35 0 top
NOREF#35  -  [Pad_e118]  3 35 0 top
NOREF#36  -  [Pad_e105]  38.41 38.41 0 top
Q1  DTC143ZEBTL  [SC-89-3_L1.6-W0.9-P1.00-LS1.6-BR]  9.27 -26.26 0 top
Q2  DTC143ZEBTL  [SC-89-3_L1.6-W0.9-P1.00-LS1.6-BR]  33.91 -22.2 0 top
Q3  DTC143ZEBTL  [SC-89-3_L1.6-W0.9-P1.00-LS1.6-BR]  111.44 -13.29 0 top
R1  18Ω  [R0805]  42.54 -65.83 0 top
R2  1kΩ  [R1206]  18.08 -25.4 0 top
R4  5.6Ω  [R1206]  95 -38.91 0 top
R5  5.6Ω  [R1206]  91.19 -49.73 0 top
R6  22Ω  [R0603]  92.47 -41.83 0 top
R7  22Ω  [R0603]  92.47 -44.37 0 top
R8  1kΩ  [R1206]  115.83 -16.12 0 top
R9  10kΩ  [R0402]  0.89 -75.28 0 top
RF1  6GHz  [SMA-SMD_HYCW12-SMAW0863-1365B]  30 37.08 90 top
U1  STM32F103C8T6  [LQFP-48_L7.0-W7.0-P0.50-LS9.0-BL]  16.51 13.33 0 top
U2  AMS1117-3.3  [SOT-223-3_L6.5-W3.4-P2.30-LS7.0-BR]  33.15 11.18 0 top
U4  SN65HVD230DR  [SOIC-8_L4.9-W3.9-P1.27-LS6.0-BL]  25.53 11.43 0 top
U5  CC1200RHBR  [VQFN-32_L5.0-W5.0-P0.50-TL-EP]  31.37 22.35 0 top
U6  L80RE-M37  [GPSM-SMD_12P-L16.0-W16.0-P2.54-BL]  14.86 29.46 270 top
U7  ST-LINK Board To Board  [ST-LINK BOARD TO BOARD]  6.5 2.5 0 bottom
U8  GT-USB-7010ASV  [USB-C-SMD_G-SWITCH_GT-USB-7010ASV]  5.84 13.08 270 top
U9  MX128-2.54-06P-GN01-Cu-Y-A  [CONN-TH_6P-P2.54_MX128-2.54-6P]  26.03 3.81 0 top
X1  40MHz  [CRYSTAL-SMD_4P-L2.0-W1.6-BL]  13 -39.97 0 top

## Footprints (pads in the part's own frame, mm; a bottom-side part is the same pattern mirrored in y, then rotated)
C0402
  rect 0.5x0.54 smd: 1(-0.42,0) 2(0.42,0)
C0603
  rect 0.8x0.9 smd: 1(-0.7,0) 2(0.7,0)
C0805
  rect 1.41x1.35 smd: 1(-1,0) 2(1,0)
CONN-TH_6P-P2.54_MX128-2.54-6P
  rect 1.8x2 hole 1.1: 1(-6.35,0)
  round 1.8 hole 1.1: 2(-3.81,0) 3(-1.27,0) 4(1.27,0) 5(3.81,0) 6(6.35,0)
CRYSTAL-SMD_4P-L2.0-W1.6-BL
  rect 0.9x0.8 smd: 1(-0.7,-0.55) 2(0.7,-0.55) 3(0.7,0.55) 4(-0.7,0.55)
GPSM-SMD_12P-L16.0-W16.0-P2.54-BL
  oval 1x2.5 smd: 1(-6.037,-7.75) 2(-3.498,-7.75) 3(-0.958,-7.75) 4(1.583,-7.75) 5(4.122,-7.75) 6(6.662,-7.75) 7(6.662,7.75) 8(4.122,7.75) 9(1.583,7.75) 10(-0.958,7.75) 11(-3.498,7.75)
  rect 2.25x2.5 smd: 12(-6.662,7.75)
L0402
  rect 0.54x0.54 smd: 1(-0.42,0) 2(0.42,0)
L0402-R-RD
  rect 0.79x0.54 smd: 1(-0.545,0) 2(0.545,0)
L0402-RD
  rect 0.79x0.54 smd: 1(-0.545,0) 2(0.545,0)
LED0603-RD
  rect 0.8x0.8 smd: 1(-0.749,0) 2(0.749,0)
LED0805-R-RD
  rect 1x1.399 smd: 1(1.05,0) 2(-1.05,0)
LQFP-48_L7.0-W7.0-P0.50-LS9.0-BL
  oval 0.27x1.5 smd: 1(-2.75,-4.25) 2(-2.25,-4.25) 3(-1.75,-4.25) 4(-1.25,-4.25) 5(-0.75,-4.25) 6(-0.25,-4.25) 7(0.25,-4.25) 8(0.75,-4.25) 9(1.25,-4.25) 10(1.75,-4.25) 11(2.25,-4.25) 12(2.75,-4.25) 25(2.75,4.25) 26(2.25,4.25) 27(1.75,4.25) 28(1.25,4.25) 29(0.75,4.25) 30(0.25,4.25) 31(-0.25,4.25) 32(-0.75,4.25) 33(-1.25,4.25) 34(-1.75,4.25) 35(-2.25,4.25) 36(-2.75,4.25)
  oval 1.5x0.27 smd: 13(4.25,-2.75) 14(4.25,-2.25) 15(4.25,-1.75) 16(4.25,-1.25) 17(4.25,-0.75) 18(4.25,-0.25) 19(4.25,0.25) 20(4.25,0.75) 21(4.25,1.25) 22(4.25,1.75) 23(4.25,2.25) 24(4.25,2.75) 37(-4.25,2.75) 38(-4.25,2.25) 39(-4.25,1.75) 40(-4.25,1.25) 41(-4.25,0.75) 42(-4.25,0.25) 43(-4.25,-0.25) 44(-4.25,-0.75) 45(-4.25,-1.25) 46(-4.25,-1.75) 47(-4.25,-2.25) 48(-4.25,-2.75)
Pad_e75
  round 5 hole 3: 1(0,0)
Pad_e82
  round 0.6 hole 0.4: 1(0,0)
Pad_e86
  round 0.6 hole 0.4: 1(0,0)
Pad_e87
  round 0.6 hole 0.4: 1(0,0)
Pad_e88
  round 0.6 hole 0.4: 1(0,0)
Pad_e89
  round 0.6 hole 0.4: 1(0,0)
Pad_e90
  round 0.6 hole 0.4: 1(0,0)
Pad_e91
  round 0.6 hole 0.4: 1(0,0)
Pad_e92
  round 0.6 hole 0.4: 1(0,0)
Pad_e95
  round 0.6 hole 0.4: 1(0,0)
Pad_e96
  round 0.6 hole 0.4: 1(0,0)
Pad_e97
  round 0.6 hole 0.4: 1(0,0)
Pad_e98
  round 0.6 hole 0.4: 1(0,0)
Pad_e99
  round 0.6 hole 0.4: 1(0,0)
Pad_e100
  round 0.6 hole 0.4: 1(0,0)
Pad_e101
  round 0.6 hole 0.4: 1(0,0)
Pad_e102
  round 0.6 hole 0.4: 1(0,0)
Pad_e103
  round 5 hole 3: 1(0,0)
Pad_e104
  round 0.6 hole 0.4: 1(0,0)
Pad_e105
  round 0.6 hole 0.4: 1(0,0)
Pad_e106
  round 0.6 hole 0.4: 1(0,0)
Pad_e107
  round 0.6 hole 0.4: 1(0,0)
Pad_e108
  round 0.6 hole 0.4: 1(0,0)
Pad_e109
  round 0.6 hole 0.4: 1(0,0)
Pad_e110
  round 0.6 hole 0.4: 1(0,0)
Pad_e111
  round 0.6 hole 0.4: 1(0,0)
Pad_e112
  round 5 hole 3: 1(0,0)
Pad_e113
  round 0.6 hole 0.4: 1(0,0)
Pad_e114
  round 0.6 hole 0.4: 1(0,0)
Pad_e115
  round 0.6 hole 0.4: 1(0,0)
Pad_e116
  round 0.6 hole 0.4: 1(0,0)
Pad_e117
  round 0.6 hole 0.4: 1(0,0)
Pad_e118
  round 0.6 hole 0.4: 1(0,0)
Pad_e119
  round 0.6 hole 0.4: 1(0,0)
Pad_e120
  round 0.6 hole 0.4: 1(0,0)
Pad_e121
  round 5 hole 3: 1(0,0)
R0402
  rect 0.566x0.54 smd: 1(-0.433,0) 2(0.433,0)
R0603
  rect 0.806x0.864 smd: 1(-0.753,0) 2(0.753,0)
R0805
  rect 1.133x1.377 smd: 1(-1,0) 2(1,0)
R1206
  rect 1.208x1.701 smd: 1(-1.479,0) 2(1.479,0)
SC-89-3_L1.6-W0.9-P1.00-LS1.6-BR
  rect 0.729x0.4 smd: 1(0.7,-0.5) 2(0.7,0.5)
  rect 0.729x0.42 smd: 3(-0.7,0)
SMA-SMD_HYCW12-SMAW0863-1365B
  rect 4.2x1.2 smd: 1(-0.001,-2.825) 2(-0.001,0) 3(-0.001,2.825)
  rect 4.2x1.2 smd far side: 4(0,2.825) 5(-0.001,-2.825)
SOD-323_L1.8-W1.3-LS2.5-RD
  rect 1x0.75 smd: 1(-1.173,0) 2(1.173,0)
SOIC-8_L4.9-W3.9-P1.27-LS6.0-BL
  oval 0.588x2.045 smd: 1(-1.905,-2.57) 2(-0.635,-2.57) 3(0.635,-2.57) 4(1.905,-2.57) 5(1.905,2.57) 6(0.635,2.57) 7(-0.635,2.57) 8(-1.905,2.57)
SOT-223-3_L6.5-W3.4-P2.30-LS7.0-BR
  rect 2.5x1.1 smd: 1(2.97,-2.3) 2(2.97,0) 3(2.97,2.3)
  rect 2.34x3.6 smd: 4(-2.97,0)
ST-LINK BOARD TO BOARD
  rect 1x4 smd: 1(0,0) 2(2,0) 3(4,0) 4(6,0) 5(8,0)
  rect 1x4 smd far side: 6(0,0) 7(2,0) 8(4,0) 9(6,0) 10(8,0)
USB-C-SMD_G-SWITCH_GT-USB-7010ASV
  oval 1x2.1 hole 0.6x1.7: 1(-4.32,1.78) 2(4.32,1.78)
  oval 1x1.8 hole 0.6x1.4: 3(4.32,-2.4) 4(-4.32,-2.4)
  rect 0.6x1.24 smd: A1B12(-3.2,2.4) A4B9(-2.4,2.4) B1A12(3.2,2.4) B4A9(2.4,2.4)
  rect 0.3x1.24 smd: A5(-1.25,2.4) A6(-0.25,2.4) A7(0.25,2.4) A8(1.25,2.4) B5(1.75,2.4) B6(0.75,2.4) B7(-0.75,2.4) B8(-1.75,2.4)
VQFN-32_L5.0-W5.0-P0.50-TL-EP
  rect 0.665x0.28 smd: 1(-2.408,1.75) 2(-2.408,1.25) 3(-2.408,0.75) 4(-2.408,0.25) 5(-2.408,-0.25) 6(-2.408,-0.75) 7(-2.408,-1.25) 8(-2.408,-1.75) 17(2.408,-1.75) 18(2.408,-1.25) 19(2.408,-0.75) 20(2.408,-0.25) 21(2.408,0.25) 22(2.408,0.75) 23(2.408,1.25) 24(2.408,1.75)
  rect 0.28x0.665 smd: 9(-1.75,-2.408) 10(-1.25,-2.408) 11(-0.75,-2.408) 12(-0.25,-2.408) 13(0.25,-2.408) 14(0.75,-2.408) 15(1.25,-2.408) 16(1.75,-2.408) 25(1.75,2.408) 26(1.25,2.408) 27(0.75,2.408) 28(0.25,2.408) 29(-0.25,2.408) 30(-0.75,2.408) 31(-1.25,2.408) 32(-1.75,2.408)
  rect 3.5x3.5 smd: 33(0,0)

## Nets
As in the schematic, except:
GND: C1.2 C2.1 C3.1 C5.1 C6.1 C9.1 C12.1 C13.1 C14.2 C16.2 C17.1 C18.1 C19.2 C20.2 C21.1 C22.1 C23.1 C24.1 C25.2 C26.1 C27.1 C28.1 C29.2 L6.2 NOREF.1 NOREF#2.1 NOREF#3.1 NOREF#4.1 NOREF#5.1 NOREF#6.1 NOREF#7.1 NOREF#8.1 NOREF#9.1 NOREF#10.1 NOREF#11.1 NOREF#12.1 NOREF#13.1 NOREF#14.1 NOREF#15.1 NOREF#16.1 NOREF#17.1 NOREF#18.1 NOREF#19.1 NOREF#20.1 NOREF#21.1 NOREF#22.1 NOREF#23.1 NOREF#24.1 NOREF#25.1 NOREF#26.1 NOREF#27.1 NOREF#28.1 NOREF#29.1 NOREF#30.1 NOREF#31.1 NOREF#32.1 NOREF#33.1 NOREF#34.1 NOREF#35.1 NOREF#36.1 Q1.2 Q2.2 Q3.2 R4.1 R5.1 RF1.1 RF1.3 U1.8 U1.23 U1.35 U1.44 U1.47 U2.1 U4.2 U4.8 U5.6 U5.14 U5.32 U6.3 U6.12 U7.1 U8.1 U8.2 U8.3 U8.4 U8.A1B12 U8.A8 U8.B1A12 U8.B8 U9.4 X1.2 X1.4

Pads without a net: RF1 4 5; U1 2 3 4 5 6 10 11 21 22 25 26 27 28 29 38 39 40 43; U2 2; U4 5; U5 10 16 33; U6 7 8 9 11; U7 6 7 10
